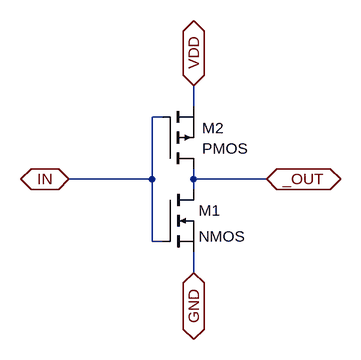
[diagram p0: schematic inverter.asc]
inverter.asc, the LTspice schematic file:
Version 4
SHEET 1 880 680
WIRE 96 224 -32 224
WIRE 96 224 96 128
WIRE 96 320 96 224
WIRE 112 128 96 128
WIRE 112 320 96 320
WIRE 160 112 160 80
WIRE 160 224 160 208
WIRE 160 240 160 224
WIRE 160 368 160 336
WIRE 272 224 160 224
FLAG 160 368 GND
IOPIN 160 368 BiDir
FLAG 160 80 VDD
IOPIN 160 80 BiDir
FLAG 272 224 _OUT
IOPIN 272 224 BiDir
FLAG -32 224 IN
IOPIN -32 224 BiDir
SYMBOL nmos 112 240 R0
SYMATTR InstName M1
SYMATTR Value2 L=1u W=10u
SYMBOL pmos 112 208 M180
WINDOW 0 61 63 Left 0
WINDOW 3 61 31 Left 0
SYMATTR InstName M2
SYMATTR Value2 L=1u W=10u

The netlist it stands for:
* inverter.asc
M1 _OUT IN GND GND NMOS L=1u W=10u
M2 _OUT IN VDD VDD PMOS L=1u W=10u
.model NMOS NMOS
.model PMOS PMOS
.lib standard.mos
.backanno
.end